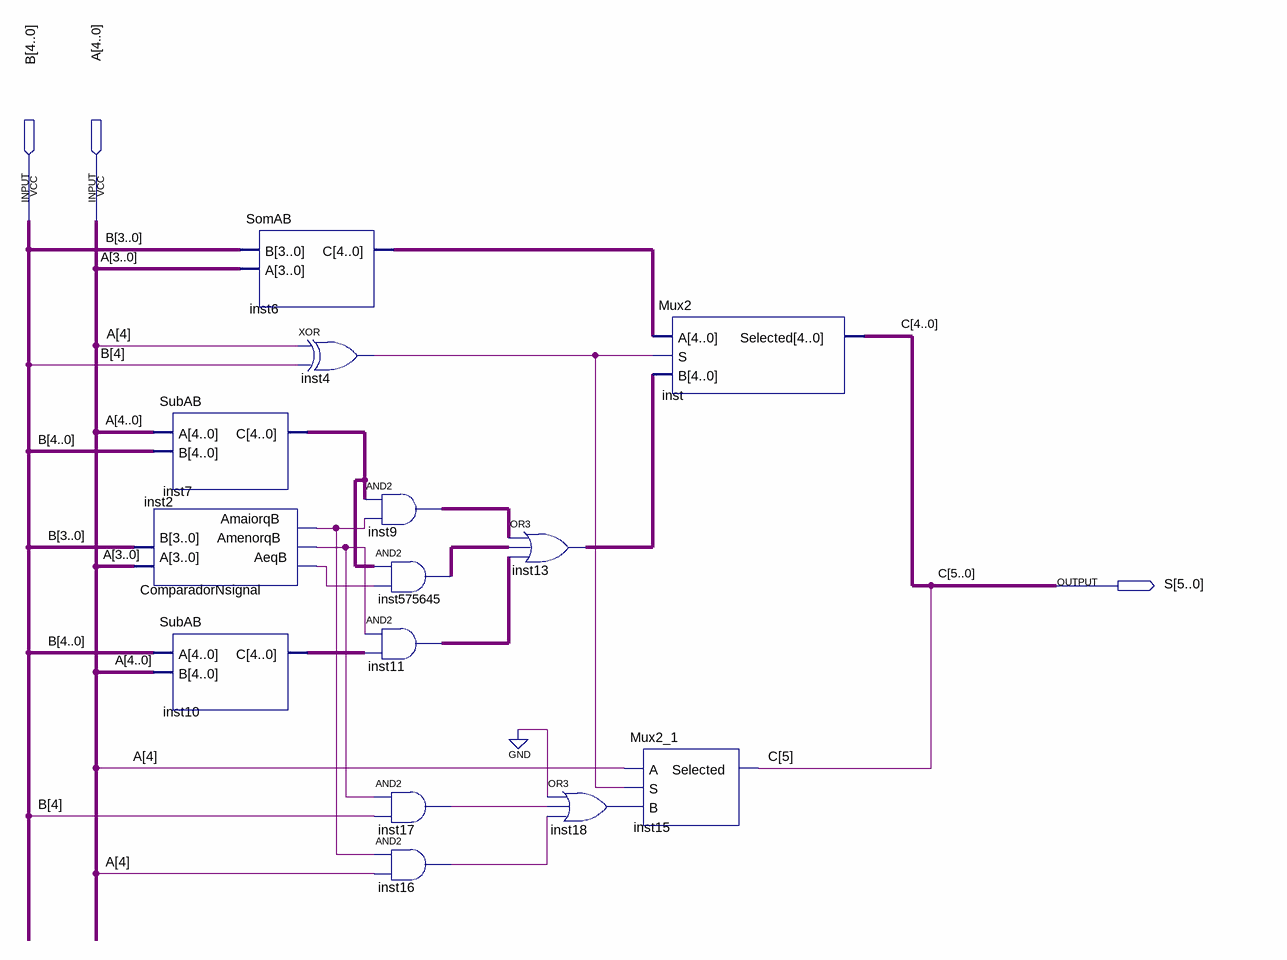
[diagram p0: schematic sheet]
// Quartus schematic Somador.bdf as structural Verilog: 14 symbols, 3 pins
module Somador (
  input  [4:0] B,
  input  [4:0] A,
  output [5:0] S
);

  wire inst2_aeqb, inst2_amaiorqb, inst2_amenorqb, inst4_out, inst16_out, inst17_out, inst18_out;
  wire [4:0] inst6_c, inst7_c, inst9_out, inst10_c, inst11_out, inst13_out, inst575645_out;

  ComparadorNsignal inst2 (
    .A(A[3:0]), .B(B[3:0]), .AeqB(inst2_aeqb), .AmenorqB(inst2_amenorqb), .AmaiorqB(inst2_amaiorqb));
  SubAB inst7 (.A(A), .B(B), .C(inst7_c));
  SubAB inst10 (.A(B), .B(A), .C(inst10_c));
  SomAB inst6 (.B(B[3:0]), .A(A[3:0]), .C(inst6_c));
  xor inst4 (inst4_out, A[4], B[4]);
  assign inst9_out = inst7_c & {5{inst2_amaiorqb}};  // AND2 inst9, 5 bits wide
  assign inst11_out = {5{inst2_amenorqb}} & inst10_c;  // AND2 inst11, 5 bits wide
  assign inst575645_out = inst7_c & {5{inst2_aeqb}};  // AND2 inst575645, 5 bits wide
  and inst17 (inst17_out, inst2_amenorqb, B[4]);
  and inst16 (inst16_out, inst2_amaiorqb, A[4]);
  assign inst13_out = inst9_out | inst575645_out | inst11_out;  // OR3 inst13, 5 bits wide
  or inst18 (inst18_out, 1'b0, inst17_out, inst16_out);
  Mux2 inst (.A(inst6_c), .S(inst4_out), .B(inst13_out), .Selected(S[4:0]));
  Mux2_1 inst15 (.A(A[4]), .S(inst4_out), .B(inst18_out), .Selected(S[5]));

  // Other names for the same wires on the sheet: C[5:0] = S
endmodule
